# EAGLE schematic supervisor (EAGLE 5.11)
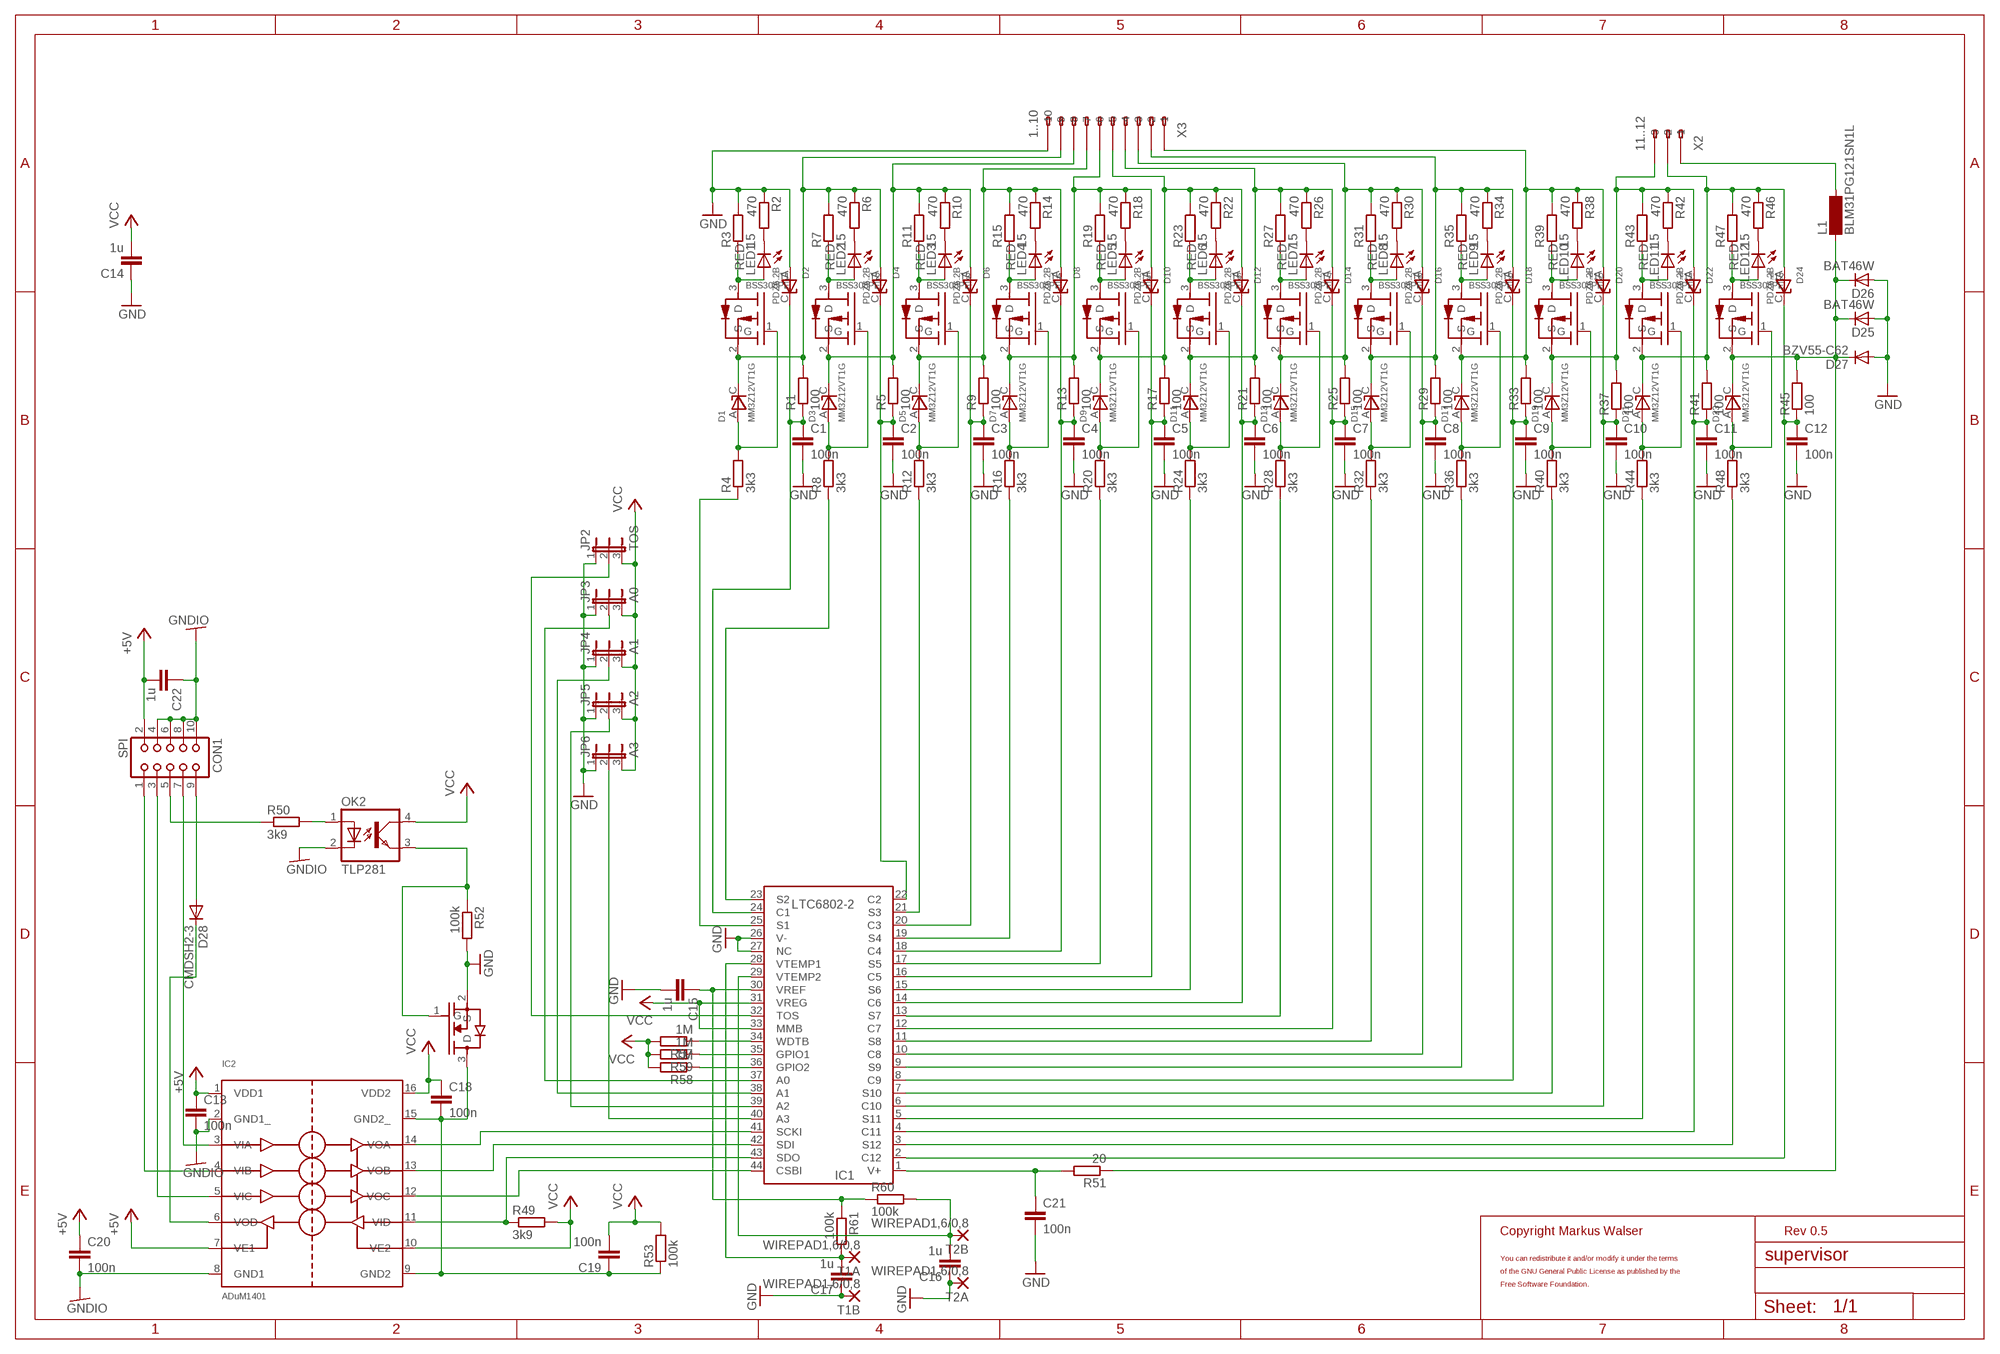
[diagram p0: schematic, sheet 1]

## Parts
C1  100n  C-EUC0603  [C0603]
C2  100n  C-EUC0603  [C0603]
C3  100n  C-EUC0603  [C0603]
C4  100n  C-EUC0603  [C0603]
C5  100n  C-EUC0603  [C0603]
C6  100n  C-EUC0603  [C0603]
C7  100n  C-EUC0603  [C0603]
C8  100n  C-EUC0603  [C0603]
C9  100n  C-EUC0603  [C0603]
C10  100n  C-EUC0603  [C0603]
C11  100n  C-EUC0603  [C0603]
C12  100n  C-EUC0603  [C0603]
C13  100n  C-EUC0603  [C0603]
C14  1u  C-EUC0603  [C0603]
C15  1u  C-EUC0603  [C0603]
C16  1u  C-EUC0603  [C0603]
C17  1u  C-EUC0603  [C0603]
C18  100n  C-EUC0603  [C0603]
C19  100n  C-EUC0603  [C0603]
C20  100n  C-EUC0603  [C0603]
C21  100n  C-EUC0603  [C0603]
C22  1u  C-EUC0603  [C0603]
CON1  SPI  CON10  [CON10]
D1  MM3Z12VT1G  MM3Z12VT1  [SOD323-R]
D2  PDZ6.2B  BZT52C6V2S  [SOD323-R]
D3  MM3Z12VT1G  MM3Z12VT1  [SOD323-R]
D4  PDZ6.2B  BZT52C6V2S  [SOD323-R]
D5  MM3Z12VT1G  MM3Z12VT1  [SOD323-R]
D6  PDZ6.2B  BZT52C6V2S  [SOD323-R]
D7  MM3Z12VT1G  MM3Z12VT1  [SOD323-R]
D8  PDZ6.2B  BZT52C6V2S  [SOD323-R]
D9  MM3Z12VT1G  MM3Z12VT1  [SOD323-R]
D10  PDZ6.2B  BZT52C6V2S  [SOD323-R]
D11  MM3Z12VT1G  MM3Z12VT1  [SOD323-R]
D12  PDZ6.2B  BZT52C6V2S  [SOD323-R]
D13  MM3Z12VT1G  MM3Z12VT1  [SOD323-R]
D14  PDZ6.2B  BZT52C6V2S  [SOD323-R]
D15  MM3Z12VT1G  MM3Z12VT1  [SOD323-R]
D16  PDZ6.2B  BZT52C6V2S  [SOD323-R]
D17  MM3Z12VT1G  MM3Z12VT1  [SOD323-R]
D18  PDZ6.2B  BZT52C6V2S  [SOD323-R]
D19  MM3Z12VT1G  MM3Z12VT1  [SOD323-R]
D20  PDZ6.2B  BZT52C6V2S  [SOD323-R]
D21  MM3Z12VT1G  MM3Z12VT1  [SOD323-R]
D22  PDZ6.2B  BZT52C6V2S  [SOD323-R]
D23  MM3Z12VT1G  MM3Z12VT1  [SOD323-R]
D24  PDZ6.2B  BZT52C6V2S  [SOD323-R]
D25  BAT46W  D-SOD123  [SOD123]
D26  BAT46W  D-SOD123  [SOD123]
D27  BZV55-C62  DIODE-MINIMELF  [MINIMELF]
D28  CMDSH2-3  DIODE-SOD323-R  [SOD323-R]
IC1  LTC6802-2  [SSOP44DL]
IC2  ADuM1401  ADUM1401  [SO16W]
JP2  TOS  JP2E  [JP2]
JP3  A0  JP2E  [JP2]
JP4  A1  JP2E  [JP2]
JP5  A2  JP2E  [JP2]
JP6  A3  JP2E  [JP2]
L1  BLM31PG121SN1L  SM-1206  [SM-1206]
LED1  RED  LEDCHIPLED_0805  [CHIPLED_0805]
LED2  RED  LEDCHIPLED_0805  [CHIPLED_0805]
LED3  RED  LEDCHIPLED_0805  [CHIPLED_0805]
LED4  RED  LEDCHIPLED_0805  [CHIPLED_0805]
LED5  RED  LEDCHIPLED_0805  [CHIPLED_0805]
LED6  RED  LEDCHIPLED_0805  [CHIPLED_0805]
LED7  RED  LEDCHIPLED_0805  [CHIPLED_0805]
LED8  RED  LEDCHIPLED_0805  [CHIPLED_0805]
LED9  RED  LEDCHIPLED_0805  [CHIPLED_0805]
LED10  RED  LEDCHIPLED_0805  [CHIPLED_0805]
LED11  RED  LEDCHIPLED_0805  [CHIPLED_0805]
LED12  RED  LEDCHIPLED_0805  [CHIPLED_0805]
OK2  TLP281  TLP283  [MINI-FLAT-4]
R1  100  R-EU_R0603  [R0603]
R2  470  R-EU_R0603  [R0603]
R3  15  R-EU_0411/12  [0411/12]
R4  3k3  R-EU_R0603  [R0603]
R5  100  R-EU_R0603  [R0603]
R6  470  R-EU_R0603  [R0603]
R7  15  R-EU_0411/12  [0411/12]
R8  3k3  R-EU_R0603  [R0603]
R9  100  R-EU_R0603  [R0603]
R10  470  R-EU_R0603  [R0603]
R11  15  R-EU_0411/12  [0411/12]
R12  3k3  R-EU_R0603  [R0603]
R13  100  R-EU_R0603  [R0603]
R14  470  R-EU_R0603  [R0603]
R15  15  R-EU_0411/12  [0411/12]
R16  3k3  R-EU_R0603  [R0603]
R17  100  R-EU_R0603  [R0603]
R18  470  R-EU_R0603  [R0603]
R19  15  R-EU_0411/12  [0411/12]
R20  3k3  R-EU_R0603  [R0603]
R21  100  R-EU_R0603  [R0603]
R22  470  R-EU_R0603  [R0603]
R23  15  R-EU_0411/12  [0411/12]
R24  3k3  R-EU_R0603  [R0603]
R25  100  R-EU_R0603  [R0603]
R26  470  R-EU_R0603  [R0603]
R27  15  R-EU_0411/12  [0411/12]
R28  3k3  R-EU_R0603  [R0603]
R29  100  R-EU_R0603  [R0603]
R30  470  R-EU_R0603  [R0603]
R31  15  R-EU_0411/12  [0411/12]
R32  3k3  R-EU_R0603  [R0603]
R33  100  R-EU_R0603  [R0603]
R34  470  R-EU_R0603  [R0603]
R35  15  R-EU_0411/12  [0411/12]
R36  3k3  R-EU_R0603  [R0603]
R37  100  R-EU_R0603  [R0603]
R38  470  R-EU_R0603  [R0603]
R39  15  R-EU_0411/12  [0411/12]
R40  3k3  R-EU_R0603  [R0603]
R41  100  R-EU_R0603  [R0603]
R42  470  R-EU_R0603  [R0603]
R43  15  R-EU_0411/12  [0411/12]
R44  3k3  R-EU_R0603  [R0603]
R45  100  R-EU_R0603  [R0603]
R46  470  R-EU_R0603  [R0603]
R47  15  R-EU_0411/12  [0411/12]
R48  3k3  R-EU_R0603  [R0603]
R49  3k9  R-EU_R0603  [R0603]
R50  3k9  R-EU_R0603  [R0603]
R51  20  R-EU_R0603  [R0603]
R52  100k  R-EU_R0603  [R0603]
R53  100k  R-EU_R0603  [R0603]
R57  1M  R-EU_R0603  [R0603]
R58  1M  R-EU_R0603  [R0603]
R59  1M  R-EU_R0603  [R0603]
R60  100k  R-EU_R0603  [R0603]
R61  100k  R-EU_R0603  [R0603]
T1  BSS308PE  SI2351DS  [SOT23]
T1A  WIREPAD1,6/0,8  [1,6/0,8]
T1B  WIREPAD1,6/0,8  [1,6/0,8]
T2  BSS308PE  SI2351DS  [SOT23]
T2A  WIREPAD1,6/0,8  [1,6/0,8]
T2B  WIREPAD1,6/0,8  [1,6/0,8]
T3  BSS308PE  SI2351DS  [SOT23]
T4  BSS308PE  SI2351DS  [SOT23]
T5  BSS308PE  SI2351DS  [SOT23]
T6  BSS308PE  SI2351DS  [SOT23]
T7  BSS308PE  SI2351DS  [SOT23]
T8  BSS308PE  SI2351DS  [SOT23]
T9  BSS308PE  SI2351DS  [SOT23]
T10  BSS308PE  SI2351DS  [SOT23]
T11  BSS308PE  SI2351DS  [SOT23]
T12  BSS308PE  SI2351DS  [SOT23]
T13  PMV30UN  FDN337N  [SOT23]
X2  11..12  233-503  [233-503]
X3  1..10  233-510  [233-510]

## Nets
+5V: C13.1 C20.1 C22.2 CON1.2 IC2.1(VDD1) IC2.7(VE1)
GND: C1.2 C2.2 C3.2 C4.2 C5.2 C6.2 C7.2 C8.2 C9.2 C10.2 C11.2 C12.2 C14.1 C15.2 C16.1 C17.1 C21.2 D2.A D25.2(A) D26.2(A) D27.A IC1.26(V-) IC1.27(NC) JP2.1 JP3.1 JP4.1 JP5.1 JP6.1 R2.1 R3.2 R52.2 T1B.1(P) T2A.1(P) T13.2(S) X3.A10(-10)
GNDIO: C13.2 C20.2 C22.1 CON1.4 CON1.6 CON1.8 CON1.10 IC2.2(GND1_) IC2.8(GND1) OK2.2(C)
N$1: LED1.C R2.2
N$2: D1.A R4.2 T1.1(G)
N$3: LED1.A R3.1 T1.3(D)
N$4: C1.1 D2.C(K) IC1.24(C1) R1.1
N$5: D1.C(K) D4.A R1.2 R6.1 R7.2 T1.2(S) X3.A9(-9)
N$6: C2.1 D4.C(K) IC1.22(C2) R5.1
N$7: C17.2 IC1.28(VTEMP1) R61.2 T1A.1(P)
N$8: IC1.23(S2) R8.1
N$9: C5.1 D10.C(K) IC1.16(C5) R17.1
N$10: D3.A R8.2 T2.1(G)
N$11: LED2.A R7.1 T2.3(D)
N$12: LED2.C R6.2
N$13: D3.C(K) D6.A R5.2 R10.1 R11.2 T2.2(S) X3.A8(-8)
N$14: C3.1 D6.C(K) IC1.20(C3) R9.1
N$15: IC1.21(S3) R12.1
N$16: IC1.17(S5) R20.1
N$17: D5.A R12.2 T3.1(G)
N$18: LED3.A R11.1 T3.3(D)
N$19: LED3.C R10.2
N$20: D5.C(K) D8.A R9.2 R14.1 R15.2 T3.2(S) X3.A7(-7)
N$21: IC1.34(WDTB) R57.1
N$22: IC1.19(S4) R16.1
N$23: D9.A R20.2 T5.1(G)
N$24: D7.A R16.2 T4.1(G)
N$25: LED4.A R15.1 T4.3(D)
N$26: LED4.C R14.2
N$27: D7.C(K) D10.A R13.2 R18.1 R19.2 T4.2(S) X3.A6(-6)
N$28: C4.1 D8.C(K) IC1.18(C4) R13.1
N$29: LED5.A R19.1 T5.3(D)
N$30: LED5.C R18.2
N$31: D9.C(K) D12.A R17.2 R22.1 R23.2 T5.2(S) X3.A5(-5)
N$32: C15.1 IC1.30(VREF) R60.1 R61.1
N$33: C6.1 D12.C(K) IC1.14(C6) R21.1
N$34: IC1.15(S6) R24.1
N$35: D11.A R24.2 T6.1(G)
N$36: LED6.A R23.1 T6.3(D)
N$37: LED6.C R22.2
N$38: D11.C(K) D14.A R21.2 R26.1 R27.2 T6.2(S) X3.A4(-4)
N$39: C16.2 IC1.29(VTEMP2) R60.2 T2B.1(P)
N$40: C7.1 D14.C(K) IC1.12(C7) R25.1
N$41: IC1.13(S7) R28.1
N$42: D13.A R28.2 T7.1(G)
N$43: LED7.A R27.1 T7.3(D)
N$44: LED7.C R26.2
N$45: D13.C(K) D16.A R25.2 R30.1 R31.2 T7.2(S) X3.A3(-3)
N$46: IC1.37(A0) JP3.2
N$47: C8.1 D16.C(K) IC1.10(C8) R29.1
N$48: IC1.11(S8) R32.1
N$49: D15.A R32.2 T8.1(G)
N$50: LED8.A R31.1 T8.3(D)
N$51: LED8.C R30.2
N$52: D15.C(K) D18.A R29.2 R34.1 R35.2 T8.2(S) X3.A2(-2)
N$53: IC1.38(A1) JP4.2
N$54: C9.1 D18.C(K) IC1.8(C9) R33.1
N$55: IC1.9(S9) R36.1
N$56: D17.A R36.2 T9.1(G)
N$57: LED9.A R35.1 T9.3(D)
N$58: LED9.C R34.2
N$59: D17.C(K) D20.A R33.2 R38.1 R39.2 T9.2(S) X3.A1(-1)
N$60: IC1.39(A2) JP5.2
N$61: C10.1 D20.C(K) IC1.6(C10) R37.1
N$62: IC1.7(S10) R40.1
N$63: D19.A R40.2 T10.1(G)
N$64: LED10.A R39.1 T10.3(D)
N$65: LED10.C R38.2
N$66: D19.C(K) D22.A R37.2 R42.1 R43.2 T10.2(S) X2.A3(-3)
N$67: IC1.40(A3) JP6.2
N$68: C11.1 D22.C(K) IC1.4(C11) R41.1
N$69: IC1.5(S11) R44.1
N$70: D21.A R44.2 T11.1(G)
N$71: LED11.A R43.1 T11.3(D)
N$72: LED11.C R42.2
N$74: IC1.43(SDO) IC2.11(VID) R49.1
N$75: C12.1 D24.C(K) IC1.2(C12) R45.1
N$76: IC1.3(S12) R48.1
N$77: D23.A R48.2 T12.1(G)
N$78: LED12.A R47.1 T12.3(D)
N$79: LED12.C R46.2
N$80: L1.2 X2.A1(-1)
N$81: IC1.44(CSBI) IC2.12(VOC)
N$82: IC1.42(SDI) IC2.13(VOB)
N$83: IC1.41(SCKI) IC2.14(VOA)
N$84: D21.C(K) D24.A R41.2 R46.1 R47.2 T11.2(S) X2.A2(-2)
N$85: IC1.32(TOS) JP2.2
N$86: C18.2 C19.1 IC2.9(GND2) IC2.15(GND2_) R53.1 T13.3(D)
N$87: IC1.35(GPIO1) R59.1
N$88: IC1.36(GPIO2) R58.1
N$89: OK2.3(EMIT) R52.1 T13.1(G)
N$90: D28.C IC2.6(VOD)
N$92: CON1.7 IC2.3(VIA)
N$93: CON1.3 IC2.5(VIC)
N$94: CON1.1 IC2.4(VIB)
N$95: CON1.9 D28.A
N$96: OK2.1(A) R50.2
N$97: CON1.5 R50.1
N$98: C21.1 IC1.1(V+) R51.2
N$100: D23.C(K) D25.1(C) D26.1(C) D27.C L1.1 R45.2 R51.1 T12.2(S)
N$103: IC1.25(S1) R4.1
VCC: C14.2 C18.1 C19.2 IC1.31(VREG) IC1.33(MMB) IC2.10(VE2) IC2.16(VDD2) JP2.3 JP3.3 JP4.3 JP5.3 JP6.3 OK2.4(COL) R49.2 R53.2 R57.2 R58.2 R59.2
Unconnected: X2.B1(B-1) X2.B2(B-2) X2.B3(B-3) X3.B1(B-1) X3.B2(B-2) X3.B3(B-3) X3.B4(B-4) X3.B5(B-5) X3.B6(B-6) X3.B7(B-7) X3.B8(B-8) X3.B9(B-9) X3.B10(B-10)

## Notes on the sheet
- Copyright Markus Walser | Rev 0.5
- You can redistribute it and/or modify it under the terms
- of the GNU General Public License as published by the
- Free Software Foundation.

## Library data of the parts
C1-C22 = resistor:C-EU: CAPACITOR, European symbol
CON1 = con-harting:CON10: CONNECTOR; OC_FARNELL: unknown; OC_NEWARK: unknown
D1 D3 D5 D7 D9 D11 D13 D15 D17 D19 D21 D23 = icontroller:MM3Z12VT1: 12V Z-Diode
D2 D4 D6 D8 D10 D12 D14 D16 D18 D20 D22 D24 = icontroller:BZT52C6V2S: 6.2V Z-Diode
D25 D26 = semicon-smd-ipc:D-: DIODE unfilled
D27 D28 = diode:DIODE-: DIODE
IC1 = ltc6802:LTC6802-2: LTC6802-2 The LTC®6802-2 is a complete battery monitoring IC that includes a 12-bit ADC, a precision voltage reference, a high voltage input multiplexer and a serial interface. Each LTC6802-2 can measure 12 series connected battery cells, with a total input voltage up to 60V. The voltage on all 12 input channels can be measured within 13ms. Many LTC6802-2 devices can be stacked to measure the voltage of each cell in a long battery string. Each LTC6802-2 has an individually addressable serial interface, allowing up to 16 LTC6802-2 devices to interface to one control processor and operate simultaneously. To minimize power, the LTC6802-2 offers a measure mode to monitor each cell for overvoltage and undervoltage conditions. A standby mode is also provided to reduce supply current to 50µA. Each cell input has an associated MOSFET switch that can discharge any overcharged cell. The related LTC6802-1 offers a serial interface that allows the serial ports of multiple LTC6802-1 devices to be daisy chained without opto-couplers or isolators.
IC2 = spisolator:ADUM1401: Quad-Channel Digital Isolators The ADuM1401 is a 3/1 quad-channel digital isolators based on Analog Devices, Inc., iCoupler® technology. Combining high speed CMOS and monolithic air core transformer technology, these isolation components provide outstanding performance characteristics superior to alternatives, such as optocoupler devices.
JP2-JP6 = jumper:JP2E: JUMPER
L1 = inductor-neosid:SM-1206: INDUCTOR SMD chip inductor
LED1-LED12 = led:LED: LED OSRAM: - CHIPLED LG R971, LG N971, LY N971, LG Q971, LY Q971, LO R971, LY R971 LH N974, LH R974 LS Q976, LO Q976, LY Q976 LO Q996 - Hyper CHIPLED LW Q18S LB Q993, LB Q99A, LB R99A - SideLED LS A670, LO A670, LY A670, LG A670, LP A670 LB A673, LV A673, LT A673, LW A673 LH A674 LY A675 LS A676, LA A676, LO A676, LY A676, LW A676 LS A679, LY A679, LG A679 - Hyper Micro SIDELED® LS Y876, LA Y876, LO Y876, LY Y876 LT Y87S - SmartLED LW L88C, LW L88S LB L89C, LB L89S, LG L890 LS L89K, LO L89K, LY L89K LS L896, LA L896, LO L896, LY L896 - TOPLED LS T670, LO T670, LY T670, LG T670, LP T670 LSG T670, LSP T670, LSY T670, LOP T670, LYG T670 LG T671, LOG T671, LSG T671 LB T673, LV T673, LT T673, LW T673 LH T674 LS T676, LA T676, LO T676, LY T676, LB T676, LH T676, LSB T676, LW T676 LB T67C, LV T67C, LT T67C, LS T67K, LO T67K, LY T67K, LW E67C LS E67B, LA E67B, LO E67B, LY E67B, LB E67C, LV E67C, LT E67C LW T67C LS T679, LY T679, LG T679 LS T770, LO T770, LY T770, LG T770, LP T770 LB T773, LV T773, LT T773, LW T773 LH T774 LS E675, LA E675, LY E675, LS T675 LS T776, LA T776, LO T776, LY T776, LB T776 LHGB T686 LT T68C, LB T68C - Hyper Mini TOPLED® LB M676 - Mini TOPLED Santana® LG M470 LS M47K, LO M47K, LY M47K Source: http://www.osram.convergy.de LUXEON: - LUMILED® LXK2-PW12-R00, LXK2-PW12-S00, LXK2-PW14-U00, LXK2-PW14-V00 LXK2-PM12-R00, LXK2-PM12-S00, LXK2-PM14-U00 LXK2-PE12-Q00, LXK2-PE12-R00, LXK2-PE12-S00, LXK2-PE14-T00, LXK2-PE14-U00 LXK2-PB12-K00, LXK2-PB12-L00, LXK2-PB12-M00, LXK2-PB14-N00, LXK2-PB14-P00, LXK2-PB14-Q00 LXK2-PR12-L00, LXK2-PR12-M00, LXK2-PR14-Q00, LXK2-PR14-R00 LXK2-PD12-Q00, LXK2-PD12-R00, LXK2-PD12-S00 LXK2-PH12-R00, LXK2-PH12-S00 LXK2-PL12-P00, LXK2-PL12-Q00, LXK2-PL12-R00 Source: www.luxeon.com KINGBRIGHT: KA-3528ASYC Source: www.kingbright.com
OK2 = optocoupler:TLP283: TOSHIBA PHOTOCOUPLER GaAs IRED & PHOTO-TRANSISTOR Source: http://www.semicon.toshiba.co.jp/td/en/Opto/Photocoupler/en_20050928_TLP283_datasheet.pdf; OC_FARNELL: unknown; OC_NEWARK: unknown
R1-R53 R57-R61 = resistor:R-EU_: RESISTOR, European symbol
T1-T12 = icontroller:SI2351DS
T1A T1B T2A T2B = wirepad:WIREPAD: Wire PAD connect wire on PCB
T13 = ltc6802:FDN337N: N-Channel Logic Level Enhancement Mode Field Effect Transistor
X2 = con-wago:233-503: WAGO Cage Clamp
X3 = con-wago:233-510: WAGO Cage Clamp